# EAGLE design marquee-neopixel (EAGLE 8.6.1)
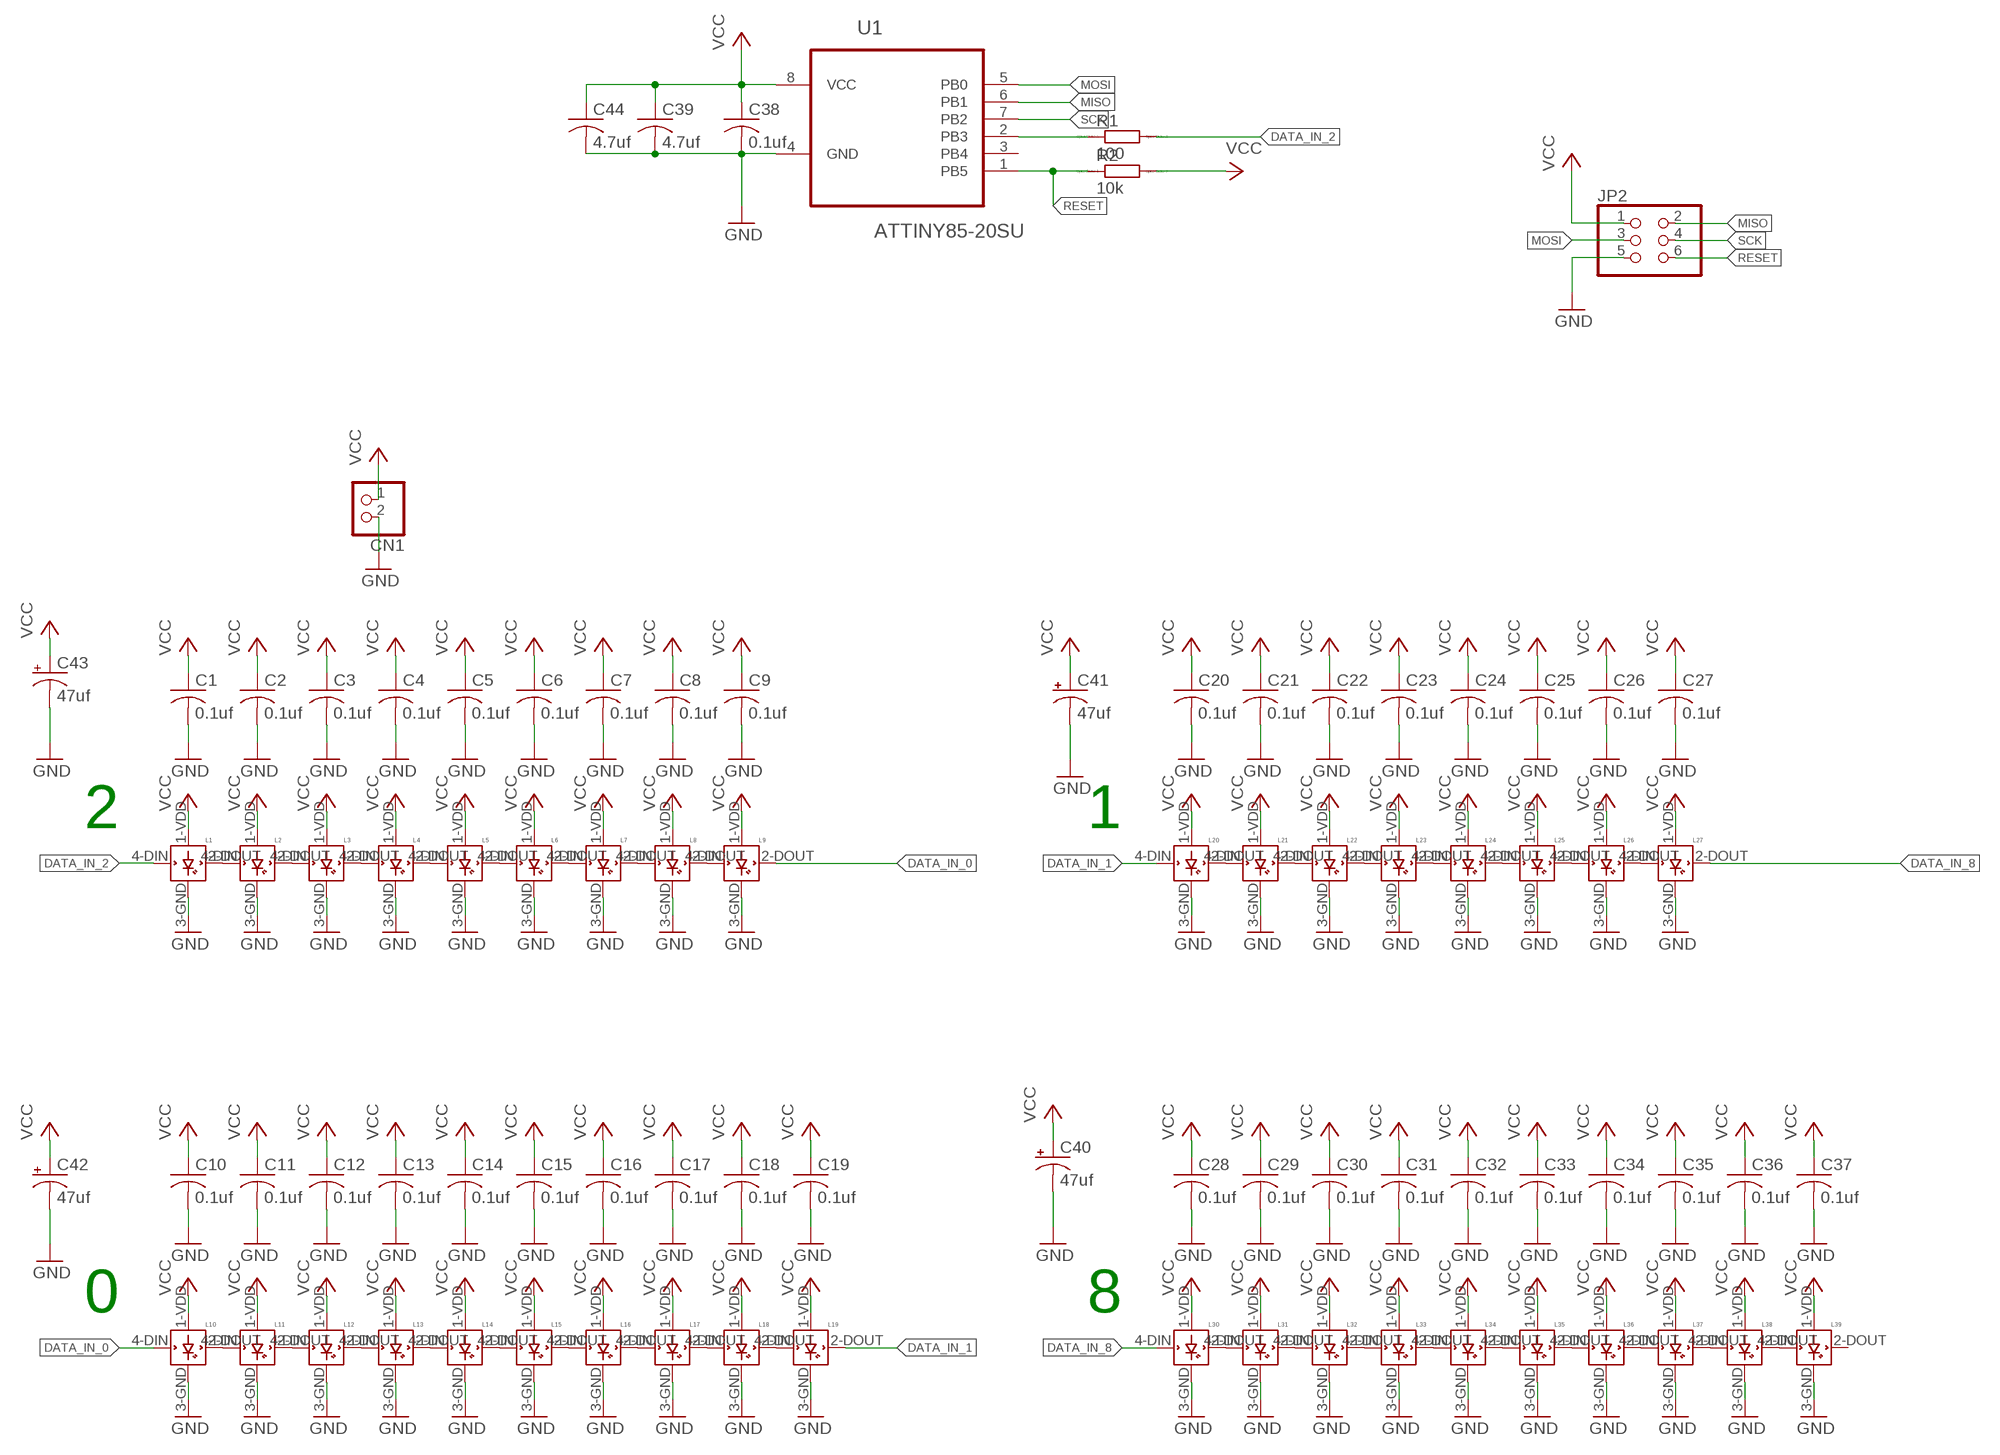
[diagram p0: schematic, sheet 1]

## Parts
C1  0.1uf  C-USC0603  [C0603]
C2  0.1uf  C-USC0603  [C0603]
C3  0.1uf  C-USC0603  [C0603]
C4  0.1uf  C-USC0603  [C0603]
C5  0.1uf  C-USC0603  [C0603]
C6  0.1uf  C-USC0603  [C0603]
C7  0.1uf  C-USC0603  [C0603]
C8  0.1uf  C-USC0603  [C0603]
C9  0.1uf  C-USC0603  [C0603]
C10  0.1uf  C-USC0603  [C0603]
C11  0.1uf  C-USC0603  [C0603]
C12  0.1uf  C-USC0603  [C0603]
C13  0.1uf  C-USC0603  [C0603]
C14  0.1uf  C-USC0603  [C0603]
C15  0.1uf  C-USC0603  [C0603]
C16  0.1uf  C-USC0603  [C0603]
C17  0.1uf  C-USC0603  [C0603]
C18  0.1uf  C-USC0603  [C0603]
C19  0.1uf  C-USC0603  [C0603]
C20  0.1uf  C-USC0603  [C0603]
C21  0.1uf  C-USC0603  [C0603]
C22  0.1uf  C-USC0603  [C0603]
C23  0.1uf  C-USC0603  [C0603]
C24  0.1uf  C-USC0603  [C0603]
C25  0.1uf  C-USC0603  [C0603]
C26  0.1uf  C-USC0603  [C0603]
C27  0.1uf  C-USC0603  [C0603]
C28  0.1uf  C-USC0603  [C0603]
C29  0.1uf  C-USC0603  [C0603]
C30  0.1uf  C-USC0603  [C0603]
C31  0.1uf  C-USC0603  [C0603]
C32  0.1uf  C-USC0603  [C0603]
C33  0.1uf  C-USC0603  [C0603]
C34  0.1uf  C-USC0603  [C0603]
C35  0.1uf  C-USC0603  [C0603]
C36  0.1uf  C-USC0603  [C0603]
C37  0.1uf  C-USC0603  [C0603]
C38  0.1uf  C-USC0603  [C0603]
C39  4.7uf  C-USC0603  [C0603]
C40  47uf  CPOL-US153CLV-0605  [153CLV-0605]
C41  47uf  CPOL-US153CLV-0605  [153CLV-0605]
C42  47uf  CPOL-US153CLV-0605  [153CLV-0605]
C43  47uf  CPOL-US153CLV-0605  [153CLV-0605]
C44  4.7uf  C-USC0603  [C0603]
CN1  JST_2PIN-SMT-RA  [JST-PH-2-SMT-RA]
JP2  PINHD-2X3  [2X03]
L1  WS2812B  [WS2812B]
L2  WS2812B  [WS2812B]
L3  WS2812B  [WS2812B]
L4  WS2812B  [WS2812B]
L5  WS2812B  [WS2812B]
L6  WS2812B  [WS2812B]
L7  WS2812B  [WS2812B]
L8  WS2812B  [WS2812B]
L9  WS2812B  [WS2812B]
L10  WS2812B  [WS2812B]
L11  WS2812B  [WS2812B]
L12  WS2812B  [WS2812B]
L13  WS2812B  [WS2812B]
L14  WS2812B  [WS2812B]
L15  WS2812B  [WS2812B]
L16  WS2812B  [WS2812B]
L17  WS2812B  [WS2812B]
L18  WS2812B  [WS2812B]
L19  WS2812B  [WS2812B]
L20  WS2812B  [WS2812B]
L21  WS2812B  [WS2812B]
L22  WS2812B  [WS2812B]
L23  WS2812B  [WS2812B]
L24  WS2812B  [WS2812B]
L25  WS2812B  [WS2812B]
L26  WS2812B  [WS2812B]
L27  WS2812B  [WS2812B]
L30  WS2812B  [WS2812B]
L31  WS2812B  [WS2812B]
L32  WS2812B  [WS2812B]
L33  WS2812B  [WS2812B]
L34  WS2812B  [WS2812B]
L35  WS2812B  [WS2812B]
L36  WS2812B  [WS2812B]
L37  WS2812B  [WS2812B]
L38  WS2812B  [WS2812B]
L39  WS2812B  [WS2812B]
R1  100  RR0603  [R0603]
R2  10k  RR0603  [R0603]
U1  ATTINY85-20SU  [SOIC127P798X216-8N]

## Nets
DATA_IN_0: L9.2-DOUT(DOUT) L10.4-DIN(DIN)
DATA_IN_1: L19.2-DOUT(DOUT) L20.4-DIN(DIN)
DATA_IN_2: L1.4-DIN(DIN) R1.2
DATA_IN_8: L27.2-DOUT(DOUT) L30.4-DIN(DIN)
GND: C1.2 C2.2 C3.2 C4.2 C5.2 C6.2 C7.2 C8.2 C9.2 C10.2 C11.2 C12.2 C13.2 C14.2 C15.2 C16.2 C17.2 C18.2 C19.2 C20.2 C21.2 C22.2 C23.2 C24.2 C25.2 C26.2 C27.2 C28.2 C29.2 C30.2 C31.2 C32.2 C33.2 C34.2 C35.2 C36.2 C37.2 C38.2 C39.2 C40.- C41.- C42.- C43.- C44.2 CN1.2 JP2.5 L1.3-GND(GND) L2.3-GND(GND) L3.3-GND(GND) L4.3-GND(GND) L5.3-GND(GND) L6.3-GND(GND) L7.3-GND(GND) L8.3-GND(GND) L9.3-GND(GND) L10.3-GND(GND) L11.3-GND(GND) L12.3-GND(GND) L13.3-GND(GND) L14.3-GND(GND) L15.3-GND(GND) L16.3-GND(GND) L17.3-GND(GND) L18.3-GND(GND) L19.3-GND(GND) L20.3-GND(GND) L21.3-GND(GND) L22.3-GND(GND) L23.3-GND(GND) L24.3-GND(GND) L25.3-GND(GND) L26.3-GND(GND) L27.3-GND(GND) L30.3-GND(GND) L31.3-GND(GND) L32.3-GND(GND) L33.3-GND(GND) L34.3-GND(GND) L35.3-GND(GND) L36.3-GND(GND) L37.3-GND(GND) L38.3-GND(GND) L39.3-GND(GND) U1.4(GND)
MISO: JP2.2 U1.6(PB1)
MOSI: JP2.3 U1.5(PB0)
N$1: L1.2-DOUT(DOUT) L2.4-DIN(DIN)
N$2: L2.2-DOUT(DOUT) L3.4-DIN(DIN)
N$3: L3.2-DOUT(DOUT) L4.4-DIN(DIN)
N$4: L4.2-DOUT(DOUT) L5.4-DIN(DIN)
N$5: L5.2-DOUT(DOUT) L6.4-DIN(DIN)
N$6: L6.2-DOUT(DOUT) L7.4-DIN(DIN)
N$7: L7.2-DOUT(DOUT) L8.4-DIN(DIN)
N$8: L8.2-DOUT(DOUT) L9.4-DIN(DIN)
N$9: L10.2-DOUT(DOUT) L11.4-DIN(DIN)
N$10: L11.2-DOUT(DOUT) L12.4-DIN(DIN)
N$11: L12.2-DOUT(DOUT) L13.4-DIN(DIN)
N$12: L13.2-DOUT(DOUT) L14.4-DIN(DIN)
N$13: L14.2-DOUT(DOUT) L15.4-DIN(DIN)
N$14: L15.2-DOUT(DOUT) L16.4-DIN(DIN)
N$15: L16.2-DOUT(DOUT) L17.4-DIN(DIN)
N$16: L17.2-DOUT(DOUT) L18.4-DIN(DIN)
N$17: L18.2-DOUT(DOUT) L19.4-DIN(DIN)
N$18: L20.2-DOUT(DOUT) L21.4-DIN(DIN)
N$19: L21.2-DOUT(DOUT) L22.4-DIN(DIN)
N$20: L22.2-DOUT(DOUT) L23.4-DIN(DIN)
N$21: L23.2-DOUT(DOUT) L24.4-DIN(DIN)
N$22: L24.2-DOUT(DOUT) L25.4-DIN(DIN)
N$23: L25.2-DOUT(DOUT) L26.4-DIN(DIN)
N$24: L26.2-DOUT(DOUT) L27.4-DIN(DIN)
N$25: R1.1 U1.2(PB3)
N$27: L30.2-DOUT(DOUT) L31.4-DIN(DIN)
N$28: L31.2-DOUT(DOUT) L32.4-DIN(DIN)
N$29: L32.2-DOUT(DOUT) L33.4-DIN(DIN)
N$30: L33.2-DOUT(DOUT) L34.4-DIN(DIN)
N$31: L34.2-DOUT(DOUT) L35.4-DIN(DIN)
N$32: L35.2-DOUT(DOUT) L36.4-DIN(DIN)
N$33: L36.2-DOUT(DOUT) L37.4-DIN(DIN)
N$34: L37.2-DOUT(DOUT) L38.4-DIN(DIN)
N$35: L38.2-DOUT(DOUT) L39.4-DIN(DIN)
RESET: JP2.6 R2.1 U1.1(PB5)
SCK: JP2.4 U1.7(PB2)
VCC: C1.1 C2.1 C3.1 C4.1 C5.1 C6.1 C7.1 C8.1 C9.1 C10.1 C11.1 C12.1 C13.1 C14.1 C15.1 C16.1 C17.1 C18.1 C19.1 C20.1 C21.1 C22.1 C23.1 C24.1 C25.1 C26.1 C27.1 C28.1 C29.1 C30.1 C31.1 C32.1 C33.1 C34.1 C35.1 C36.1 C37.1 C38.1 C39.1 C40.+ C41.+ C42.+ C43.+ C44.1 CN1.1 JP2.1 L1.1-VDD(VDD) L2.1-VDD(VDD) L3.1-VDD(VDD) L4.1-VDD(VDD) L5.1-VDD(VDD) L6.1-VDD(VDD) L7.1-VDD(VDD) L8.1-VDD(VDD) L9.1-VDD(VDD) L10.1-VDD(VDD) L11.1-VDD(VDD) L12.1-VDD(VDD) L13.1-VDD(VDD) L14.1-VDD(VDD) L15.1-VDD(VDD) L16.1-VDD(VDD) L17.1-VDD(VDD) L18.1-VDD(VDD) L19.1-VDD(VDD) L20.1-VDD(VDD) L21.1-VDD(VDD) L22.1-VDD(VDD) L23.1-VDD(VDD) L24.1-VDD(VDD) L25.1-VDD(VDD) L26.1-VDD(VDD) L27.1-VDD(VDD) L30.1-VDD(VDD) L31.1-VDD(VDD) L32.1-VDD(VDD) L33.1-VDD(VDD) L34.1-VDD(VDD) L35.1-VDD(VDD) L36.1-VDD(VDD) L37.1-VDD(VDD) L38.1-VDD(VDD) L39.1-VDD(VDD) R2.2 U1.8(VCC)
Unconnected: L39.2-DOUT(DOUT) U1.3(PB4)

## Notes on the sheet
- 2 | 1
- 0 | 8

## Library data of the parts
C1-C39 C44 = rcl:C-US: CAPACITOR, American symbol; SPICEPREFIX: C
C40-C43 = rcl:CPOL-US: POLARIZED CAPACITOR, American symbol; SPICEPREFIX: C
CN1 = adafruit-2014:JST_2PIN: JST 2-Pin Connectors of various flavors SMT-RA (S2B-PH-SM4) 4UConnector #17311 SMT (B2B-PH-SM4) THM-RA (S2B-PH) THM (B2B-PH)
JP2 = pinhead:PINHD-2X3: PIN HEADER
L1-L9 = Duly_Drive-FINAL:WS2812B; SPICEPREFIX: E
L10-L27 L30-L39 = Duly_Drive-FINAL:WS2812B
R1 R2 = eagle-ltspice:R: RESISTOR, European symbol; SPICEMODEL: NONE; SPICEPREFIX: R
U1 = Atmel_By_element14_Batch_1:ATTINY85-20SU: 8-bit Microcontroller with In-System Programmable Flash; MPN: ATTINY85-20SU; OC_FARNELL: 1455164; OC_NEWARK: 58M3797; PACKAGE: SOIC-8; SUPPLIER: Atmel

## Board
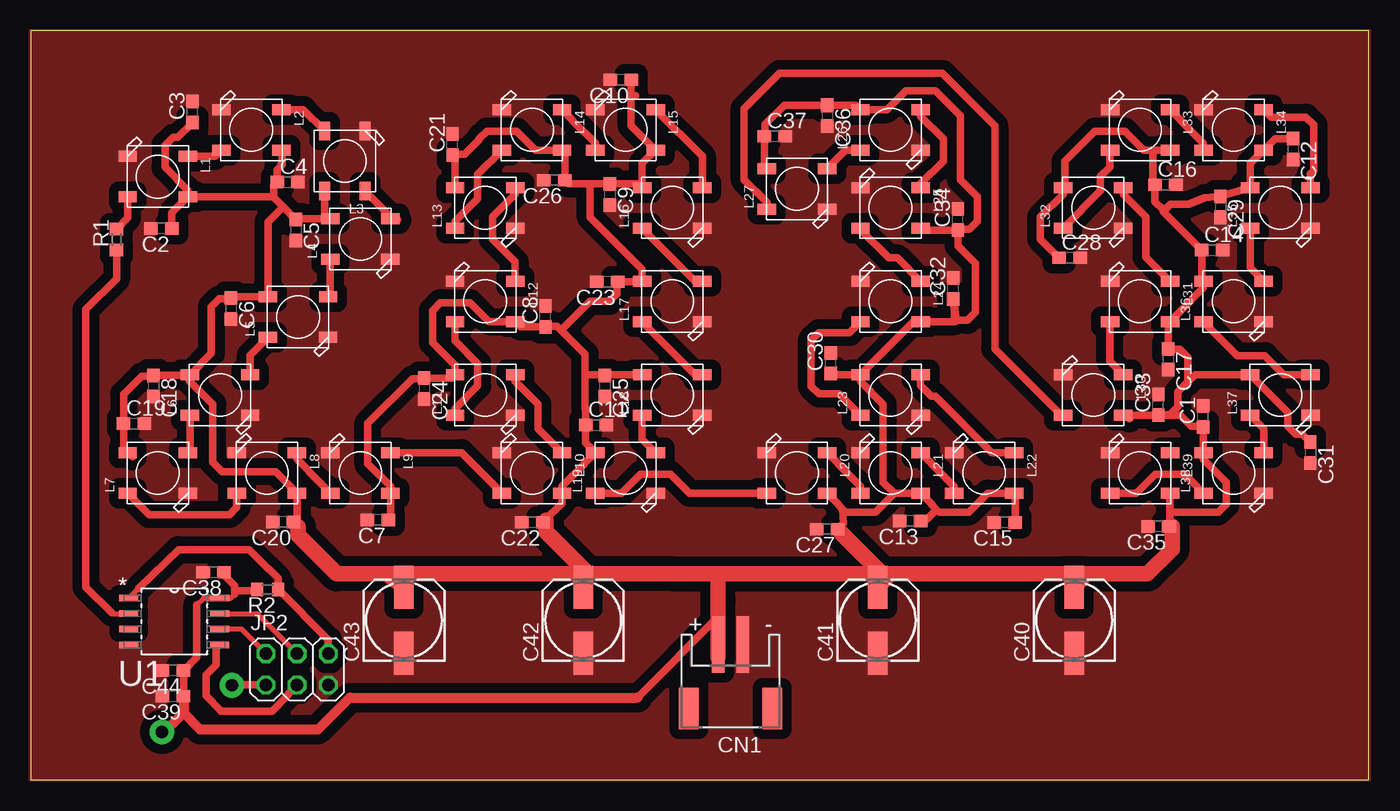
[diagram p1: board, top side]
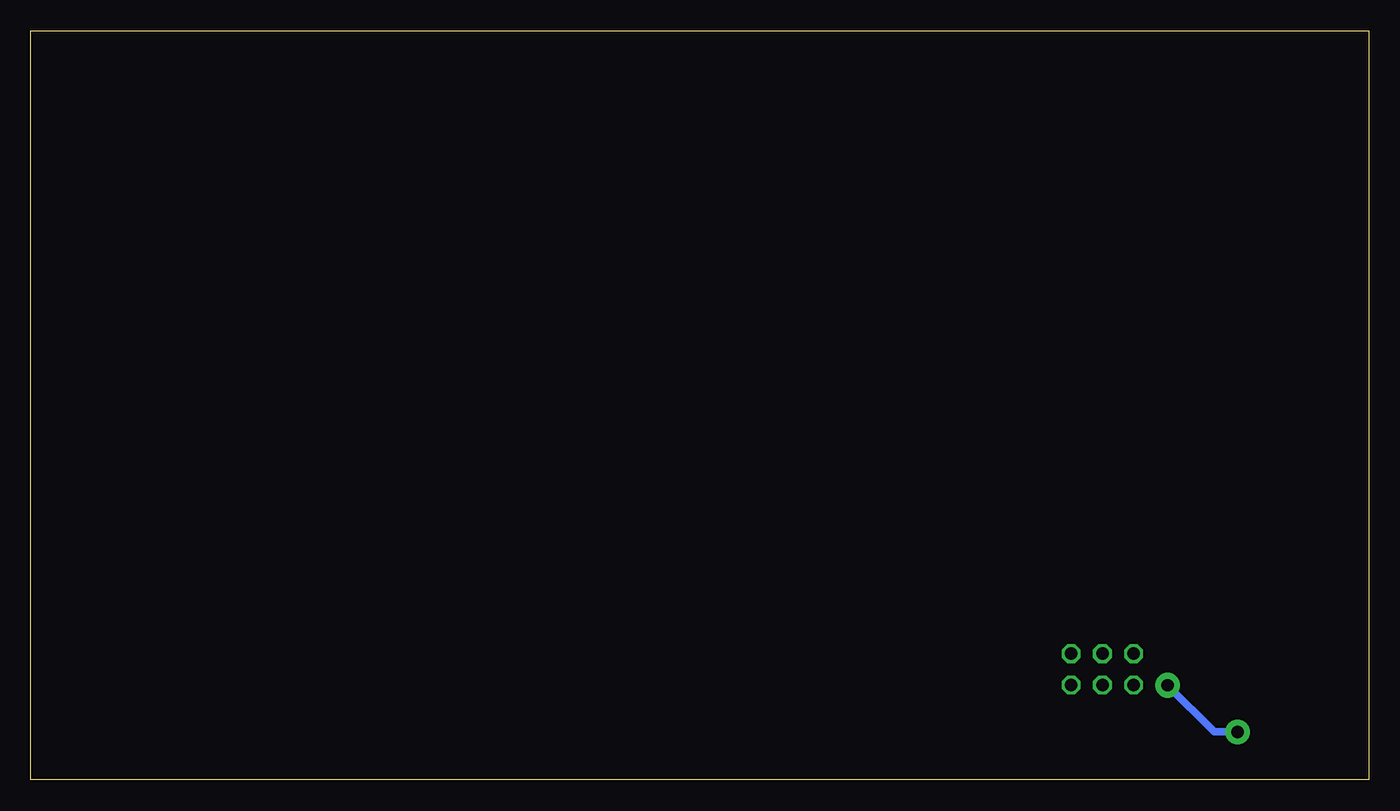
[diagram p2: board, bottom side, seen from below]

Size 109 x 61 mm. Coordinates in mm from the lower left corner, seen from the top.
Outline: 0,0 109,0 109,61 0,61 0,0
Copper layers (1*16): Top 0.035mm / dielectric 1.5mm / Bottom 0.035mm
Design rules "OthermillDRC_1_32_v2": minimum track width 8mil, minimum drill 0.8mm, track to track 0.794003125mm, track to pad 0.794003125mm, pad to pad 0.794003125mm, via to via 0.794003125mm, smd to smd 0mil, copper to edge 0mil, drill to drill 1mil, minimum pad ring 10mil, minimum via ring 10mil, stop-mask expansion 1mil, vias tented up to drill 30mil, thermal gap 10mil

### Footprints (pad centres in the part's own frame; a part is rotated, then mirrored left to right if it is on the bottom)
C0603 = smd 1.1 x 1: 1 -0.85,0; 2 0.85,0
153CLV-0605 = smd 3.5 x 1.6: + 2.7,0; - -2.7,0
JST-PH-2-SMT-RA = smd 1 x 4.6: 1 1,-3.7; 2 -1,-3.7 | smd 1.6 x 3.4: NC1 -3.4,1.5; NC2 3.4,1.5
2X03 = drill 1.016 octagon: 1 -2.54,-1.27; 2 -2.54,1.27; 3 0,-1.27; 4 0,1.27; 5 2.54,-1.27; 6 2.54,1.27
WS2812B = smd 1.5 x 0.9: 1-VDD 2.45,-1.65; 2-DOUT 2.45,1.65; 3-GND -2.45,1.65; 4-DIN -2.45,-1.65
R0603 = smd 1 x 1.1: 1 -0.85,0; 2 0.85,0
SOIC127P798X216-8N = smd 1.549 x 0.533: 1 -3.708,1.905; 2 -3.708,0.635; 3 -3.708,-0.635; 4 -3.708,-1.905; 5 3.708,-1.905; 6 3.708,-0.635; 7 3.708,0.635; 8 3.708,1.905

### Placement (x,y rotation side)
C1  95.49,29.59 90 top
C2  10.65,44.89 180 top
C3  13.18,54.37 90 top
C4  20.93,48.68 0 top
C5  21.6,44.77 270 top
C6  16.32,38.37 270 top
C7  28.27,21.16 180 top
C8  41.94,37.73 90 top
C9  47.18,47.67 270 top
C10  48.07,57 180 top
C11  46.05,28.9 0 top
C12  102.82,51.37 270 top
C13  71.65,21.08 180 top
C14  96.23,43.14 0 top
C15  79.35,20.96 180 top
C16  92.43,48.46 0 top
C17  92.66,34.25 270 top
C18  9.99,32.08 270 top
C19  8.42,29.01 0 top
C20  20.56,20.99 180 top
C21  34.37,51.72 90 top
C22  40.86,20.97 180 top
C23  46.98,40.55 180 top
C24  32.05,31.86 270 top
C25  46.77,32.08 270 top
C26  42.66,48.83 180 top
C27  64.88,20.41 180 top
C28  84.62,42.51 0 top
C29  96.91,46.66 270 top
C30  65.17,33.92 90 top
C31  104.23,26.66 270 top
C32  75.15,40.02 90 top
C33  91.85,30.54 90 top
C34  75.53,45.62 90 top
C35  91.86,20.63 180 top
C36  64.89,54.08 270 top
C37  60.62,52.41 0 top
C38  14.9,16.9 180 top
C39  11.6,6.8 180 top
C40  85,13 90 top
C41  69,13 90 top
C42  45,13 90 top
C43  30.4,13 90 top
C44  11.6,8.9 180 top
CN1  57,7.3 180 top
JP2  21.7,9 0 top
L1  10.35,49.12 0 top
L2  17.97,52.93 0 top
L3  25.59,50.39 270 top
L4  26.86,44.04 180 top
L5  21.78,37.69 180 top
L6  15.43,31.34 180 top
L7  10.35,24.99 180 top
L8  19.24,24.99 0 top
L9  26.86,24.99 0 top
L10  40.83,24.99 0 top
L11  37.02,31.34 180 top
L12  37.02,38.96 0 top
L13  37.02,46.58 180 top
L14  40.83,52.93 0 top
L15  48.45,52.93 0 top
L16  52.26,46.58 180 top
L17  52.26,38.96 180 top
L18  52.26,31.34 180 top
L19  48.45,24.99 180 top
L20  62.42,24.99 0 top
L21  70.04,24.99 0 top
L22  77.66,24.99 0 top
L23  70.04,31.34 180 top
L24  70.04,38.96 0 top
L25  70.04,46.58 0 top
L26  70.04,52.93 180 top
L27  62.42,48.12 180 top
L30  86.55,31.34 0 top
L31  90.36,38.96 0 top
L32  86.55,46.58 180 top
L33  90.36,52.93 0 top
L34  97.98,52.93 0 top
L35  101.79,46.58 180 top
L36  97.98,38.96 180 top
L37  101.79,31.34 180 top
L38  97.98,24.99 180 top
L39  90.36,24.99 0 top
R1  7,44 90 top
R2  19.3,15.5 180 top
U1  11.7,12.9 0 top

### Tracks (layer width: path | path; a pad name or v marks a point on that pad's centre or on a via)
DATA_IN_0
  Top 0.61: L9.2-DOUT 35.08,26.64 L10.4-DIN
DATA_IN_1
  Top 0.61: L19.2-DOUT 48.15,23.34 49.7,24.89 52.1,24.89 53.65,23.34 L20.4-DIN
DATA_IN_2
  Top 0.61: R1.2 7.9,45.75 L1.4-DIN
DATA_IN_8
  Top 0.61: L30.4-DIN 83.94,29.69 78.53,35.1 78.53,53.28 74.28,57.53 61,57.53 58.12,54.65 58.12,48.87 59.97,47.02 L27.2-DOUT
GND
  pour Top (isolate 0.32, no thermals): 0,61 109,61 109,0 0,0
MISO
  Top 0.406: JP2.2 17.16,12.27 U1.6
MOSI
  Top 0.406: U1.5 15.8,10.99 15.1,10.7
  Top 0.61: 15.1,10.7 15.1,9.37 14.3,8.57 14.3,6.83 15.53,5.6 19.66,5.6 21.02,6.96 21.02,7.05 JP2.3
N$1
  Top 0.61: L1.2-DOUT 15.01,50.77 L2.4-DIN
N$2
  Top 0.61: L3.4-DIN 22.2,54.58 L2.2-DOUT
N$3
  Top 0.61: L3.2-DOUT 29.58,45.6 | 29.58,45.6 29.9,45.6 | 29.58,45.6 29.4,45.6 L4.4-DIN
N$4
  Top 0.61: L4.2-DOUT 24.41,39.52 L5.4-DIN
N$5
  Top 0.61: L6.4-DIN 17.88,34.59 L5.2-DOUT
N$6
  Top 0.61: L6.2-DOUT 12.98,26.82 L7.4-DIN
N$7
  Top 0.61: L7.2-DOUT 9.64,21.6 16.2,21.6 16.79,22.19 L8.4-DIN
N$8
  Top 0.61: L9.4-DIN 23.54,24.21 23.54,24.25 21.69,26.09 L8.2-DOUT
N$9
  Top 0.61: L10.2-DOUT 41.32,28.6 41.32,30.59 39.47,32.44 L11.4-DIN
N$10
  Top 0.61: L11.2-DOUT 34.57,30.24 36.42,32.09 36.42,33.9 34.57,35.74 L12.4-DIN
N$11
  Top 0.61: L12.2-DOUT 39.47,42.18 37.62,44.02 37.62,45.84 39.47,47.68 L13.4-DIN
N$12
  Top 0.61: L13.2-DOUT 34.57,45.48 36.42,47.33 36.42,49.32 L14.4-DIN
N$13
  Top 0.61: L14.2-DOUT 44.15,53.71 44.15,53.67 46,51.83 L15.4-DIN
N$14
  Top 0.61: L15.2-DOUT 54.71,50.77 L16.4-DIN
N$15
  Top 0.61: L16.2-DOUT 54.13,40.61 L17.4-DIN
N$16
  Top 0.61: L17.2-DOUT 54.13,32.99 L18.4-DIN
N$17
  Top 0.61: L18.2-DOUT 49.81,27.73 L19.4-DIN
N$18
  Top 0.61: L20.2-DOUT 65.74,25.77 65.74,25.73 67.59,23.89 L21.4-DIN
N$19
  Top 0.61: L21.2-DOUT 73.36,25.77 73.36,25.73 75.21,23.89 L22.4-DIN
N$20
  Top 0.61: L22.2-DOUT 78.29,26.64 73.69,31.24 73.36,31.24 72.49,32.11 L23.4-DIN
N$21
  Top 0.61: L23.2-DOUT 65.86,31.42 64.22,31.42 63.57,32.06 63.57,35.77 64.22,36.42 66.7,36.42 L24.4-DIN
N$22
  Top 0.61: L24.2-DOUT 70.6,42.5 69.9,42.5 67.59,44.81 L25.4-DIN
N$23
  Top 0.61: L25.2-DOUT 72.49,48.53 74.34,50.38 74.34,52.19 72.49,54.03 L26.4-DIN
N$24
  Top 0.61: L27.4-DIN 66.38,51.28 L26.2-DOUT
N$25
  Top 0.406: 6.6,13.6 6.67,13.54 U1.2
  Top 0.61: R1.1 7,40.8 4.5,38.3 4.5,15.7 6.6,13.6
N$27
  Top 0.61: L30.2-DOUT 87.91,34.08 L31.4-DIN
N$28
  Top 0.61: L32.4-DIN 89,47.68 90.85,45.84 90.85,42.57 L31.2-DOUT
N$29
  Top 0.61: L32.2-DOUT 87.15,47.98 87.15,49.13 87.91,49.89 L33.4-DIN
N$30
  Top 0.61: L33.2-DOUT 93.68,53.71 93.68,53.67 95.53,51.83 L34.4-DIN
N$31
  Top 0.61: L35.4-DIN 104.24,49.34 104.52,49.62 104.52,53.33 103.88,53.97 101.04,53.97 L34.2-DOUT
N$32
  Top 0.61: L35.2-DOUT 99.34,41.7 L36.4-DIN
N$33
  Top 0.61: L36.2-DOUT 98.3,34.54 100.55,34.54 102.09,32.99 L37.4-DIN
N$34
  Top 0.61: L37.2-DOUT 100.43,28.6 L38.4-DIN
N$35
  Top 0.61: L38.2-DOUT 94.66,24.21 94.66,24.25 94.02,24.89 91.61,24.89 90.06,23.34 L39.4-DIN
RESET
  Top 0.406: U1.1 8.79,15.6 8.8,15.6
  Top 0.61: 8.8,15.6 12.05,18.75 17.8,18.75 19.4,17.15 19.41,17.15 20.15,16.4 R2.1 24.24,11.41 JP2.6
SCK
  Top 0.406: U1.7 18.43,13.54 JP2.4
VCC  (via drill 1 pad 2)
  Top 0.406: 13.54,14.26 14.08,14.8 U1.8 16.3,14.8 16.6,15.1
  Top 0.61: 20.47,50.08 20.42,50.12 | L1.1-VDD 19.77,47.47 | 24,45.69 21.67,45.69 C5.1 20.56,46.66 | 24,45.69 L4.1-VDD | 19.77,47.47 19.77,47.45 20.56,46.66 | L3.1-VDD 23.94,45.75 24,45.69 | 19.77,47.47 19.77,48.37 C4.1 20.08,49.69 20.47,50.08 | 20.47,50.08 20.47,51.23 L2.1-VDD | 20.56,46.66 19.33,45.43 L5.1-VDD 16.44,39.34 C6.1 16.27,39.17 15.37,39.17 14.72,38.52 14.72,34.73 L6.1-VDD 12.92,32.93 | 12.92,32.93 C18.1 9.94,32.88 9.04,32.88 7.57,31.41 C19.1 7.57,27.03 7.96,26.64 | 8.3,26.3 7.96,26.64 | 7.96,26.64 L7.1-VDD | 29.07,21.11 C7.1 29.31,21.35 L9.1-VDD 29.31,23.89 27.46,25.73 27.46,29.02 31.09,32.66 32,32.66 C24.1 34.29,32.71 L11.1-VDD 34.57,33.76 32.72,35.61 32.72,38.22 33.37,38.86 35.77,38.86 37.32,37.31 L12.1-VDD 39.9,36.88 C8.1 41.99,36.93 42.9,36.93 43.21,36.61 | 12.92,32.93 12.92,32.5 14.83,30.59 14.83,25.85 15.59,25.09 19.94,25.09 L8.1-VDD 21.69,21.27 C20.1 21.41,20.49 21.8,19.9 | C2.1 11.5,46.17 L1.1-VDD | C3.1 11.98,52.32 11.6,52.32 10.95,51.67 10.95,49.87 12.8,48.02 L1.1-VDD | 48.92,55.7 48.92,53.26 L15.1-VDD 49.81,50.19 L16.1-VDD 49.52,48.52 C9.1 45.4,48.52 | 48.92,55.7 C10.1 | 45.4,48.52 43.82,48.52 C26.1 43.51,51.05 L14.1-VDD 41.13,51.28 39.59,52.83 37.17,52.83 36.53,52.19 36.53,52.13 35.33,50.92 34.42,50.92 C21.1 34.57,50.67 L13.1-VDD | 45.4,48.52 45.58,48.34 45.58,45.81 49.81,41.59 L17.1-VDD 49.75,40.55 C23.1 47.78,40.5 47.78,39.59 47.13,38.95 45.55,38.95 43.21,36.61 | L18.1-VDD 46.83,32.99 | 46.83,32.99 C25.1 | 41.87,21.13 43.28,22.54 L10.1-VDD 43.28,23.89 45.13,25.73 45.13,25.77 L19.1-VDD 45.2,27.44 C11.1 45.2,30.2 45.17,30.23 45.17,33.1
  Top 0.61: 41.87,21.13 C22.1 | 43.21,36.61 45.17,34.66 45.17,33.1 | 46.83,32.99 45.28,32.99 45.17,33.1 | 66.14,22.04 65.74,22.43 65.74,22.47 L20.1-VDD | 66.14,22.04 66.39,21.79 68.8,21.79 70.34,23.34 | 70.34,23.34 L21.1-VDD 73.36,22.47 73.36,22.43 73.8,22 | 73.8,22 74,21.79 76.42,21.79 77.96,23.34 L22.1-VDD 80.2,23.25 C15.1 | 66.14,22.04 66.21,20.91 C27.1 66.4,19.74 66,20.1 | C13.1 72.88,21.08 73.8,22 | L25.1-VDD 72.65,44.77 75.5,44.77 | 75.5,44.77 C34.1 75.53,44.4 | 49.27,55.7 48.92,55.7 | 75.55,44.82 75.5,44.77 | 75.53,44.4 75.53,43.49 76.95,42.08 76.95,38.06 76.31,37.42 75.4,37.42 C32.1 75.29,37.31 L24.1-VDD 71.91,37.31 L23.1-VDD | C33.1 89.79,29.69 89.5,29.4 89.21,29.69 L30.1-VDD | C33.1 93.64,29.69 94.53,28.79 95.44,28.79 C1.1 95.53,28.7 L38.1-VDD 95.53,26.09 97.38,24.25 97.38,22.43 96.73,21.79 94.33,21.79 94.32,21.8 92.8,21.8 | C33.1 91.9,29.74 92.81,29.74 93.45,30.39 93.45,31.59 94.26,32.4 | 94.26,32.4 94.26,34.41 93.61,35.05 92.71,35.05 C17.1 92.66,37.16 L31.1-VDD 93.68,38.18 93.68,38.22 95.53,40.06 L36.1-VDD 95.38,40.76 C14.1 92.25,46.27 | 94.26,32.4 94.85,32.99 L37.1-VDD 102.39,29.94 102.39,28.79 103.03,28.14 103.6,28.14 C31.1 | C12.1 101.37,52.22 L34.1-VDD 99.34,50.19 L35.1-VDD 99.32,48.21 C29.1 95.63,47.41 94.28,46.86 92.85,46.86 92.25,46.27 | 92.25,46.27 92.25,46.42 91.58,47.09 C16.1 91.4,48.64 91.4,51.28 | 75.53,44.4 75.95,44.82 76.48,44.82 77.13,45.47 77.13,47.48 75.74,48.86 75.74,54.08 73.69,56.13 71.28,56.13 69.74,54.58 L26.1-VDD 67.24,54.93 C36.1 61.39,54.93 59.82,53.37 59.82,52.46 C37.1 59.77,49.97 L27.1-VDD | 70.34,23.34 69.44,24.25 69.44,30.59 67.59,32.44 L23.1-VDD
  Top 0.61: 92.8,21.8 92.8,20.72 C35.1 92.99,20.63 | 92.8,21.8 92.81,21.81 L39.1-VDD | 41.99,21.13 41.87,21.13 | L23.1-VDD 65.25,32.99 C30.1 | C28.1 82.9,43.38 82.89,43.38 82.25,44.02 82.25,45.84 84.1,47.68 L32.1-VDD 84.26,48.39 84.26,50.38 86.7,52.83 89.11,52.83 90.66,51.28 91.4,51.28 | L33.1-VDD 91.4,51.28 | C38.1 15.75,16.66 16.6,15.81 16.6,15.4 | 13.54,14.26 13.54,9.98 C44.1 C39.1 12.5,6.8 | 16.6,15.4 16.6,15.1 | 49.43,6.7 56,13.27 56,14.6 | R2.2 18.35,15.4 16.6,15.4 | JP2.1 16.43,7.73 v16.4,7.7
  Top 0.813: CN1.1 56,10 | 49.43,6.7 25.98,6.7 23.38,4.1 13.8,4.1 12.45,5.45 | C39.1 12.45,5.45 | 12.45,5.45 10.9,3.9 v10.7,3.9
  Top 1.27: 52.37,16.77 45.4,16.8 41.99,20.21 41.99,21.13 | 52.37,16.77 56,16.77 | 56,16.77 69.33,16.77 | 70,16.77 86,16.77 | 86,16.77 90.97,16.77 92.99,18.79 92.99,20.63 | 52.37,16.77 45,16.77 | 45,16.77 29,16.77 | 29,16.77 24.93,16.77 21.8,19.9 21.8,20.6 | C41.+ 70,16.77 | C42.+ 45,16.77 | C43.+ 29,16.77 | C40.+ 86,16.77 | 66,20.1 69.33,16.77 | 69.33,16.77 70,16.77 | 56,10 56,14.6 56,16.77
  Bottom 0.61: v16.4,7.7 12.6,3.9 v10.7,3.9